# EAGLE design repeater (EAGLE 7.2.0)
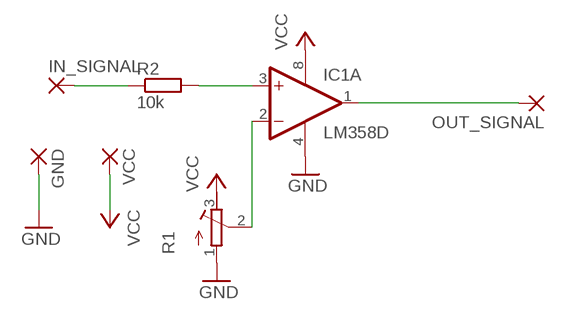
[diagram p0: schematic, sheet 1]

## Parts
GND  SMD5  [SMD2,54-5,08]
IC1  LM358D  [SO08]
IN_SIGNAL  SMD5  [SMD2,54-5,08]
OUT_SIGNAL  SMD5  [SMD2,54-5,08]
R1  R-TRIMM3296W  [RTRIM3296W]
R2  10k  R-EU_R0805  [R0805]
VCC  SMD5  [SMD2,54-5,08]

## Nets
GND: GND.1(P) IC1.4(P:V-) R1.1(A)
N$1: IC1.2(A:-IN) R1.2(S)
N$2: IC1.3(A:+IN) R2.2
N$3: IN_SIGNAL.1(P) R2.1
N$4: IC1.1(A:OUT) OUT_SIGNAL.1(P)
VCC: IC1.8(P:V+) R1.3(E) VCC.1(P)
Unconnected: IC1.5(B:+IN) IC1.6(B:-IN) IC1.7(B:OUT)

## Library data of the parts
GND IN_SIGNAL OUT_SIGNAL VCC = wirepad:SMD5: SMD PAD
IC1 = linear:LM358: OP AMP also LM158; LM258; LM2904 Source: http://cache.national.com/ds/LM/LM158.pdf
R1 = rcl:R-TRIMM: Trimm resistor
R2 = rcl:R-EU_: RESISTOR, European symbol

## Board
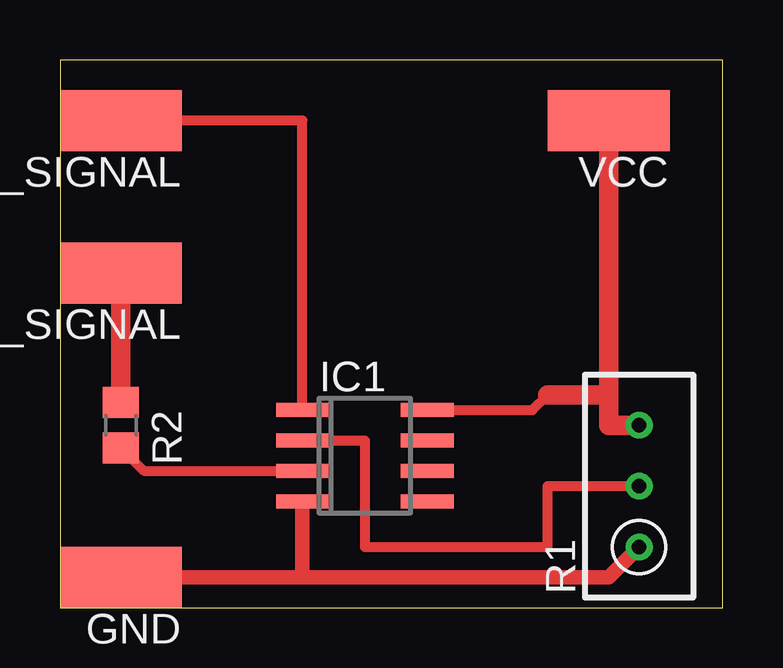
[diagram p1: board, top side]

Size 27.61 x 22.85 mm. Coordinates in mm from the lower left corner, seen from the top.
Outline: 0,0 27.61,0 27.61,22.85 0,22.85 0,0
Copper layers (1*16): Top 0.035mm / dielectric 1.5mm / Bottom 0.035mm
Design rules "default": minimum track width 10mil, minimum drill 24mil, track to track 8mil, track to pad 8mil, pad to pad 8mil, via to via 8mil, smd to smd 8mil, copper to edge 40mil, drill to drill 8mil, minimum pad ring 10mil, minimum via ring 8mil, stop-mask expansion 4mil, vias tented up to drill 0mil, thermal gap 10mil

### Footprints (pad centres in the part's own frame; a part is rotated, then mirrored left to right if it is on the bottom)
SMD2,54-5,08 = smd 2.54 x 5.08: 1 0,0
SO08 = smd 0.6 x 2.2: 1 -1.905,-2.6; 2 -0.635,-2.6; 3 0.635,-2.6; 4 1.905,-2.6; 5 1.905,2.6; 6 0.635,2.6; 7 -0.635,2.6; 8 -1.905,2.6
RTRIM3296W = drill 0.61: 1 0,-2.54; 2 0,0; 3 0,2.54
R0805 = smd 1.3 x 1.5: 1 -0.95,0; 2 0.95,0

### Placement (x,y rotation side)
GND  2.54,1.27 90 top
IC1  12.7,6.35 270 top
IN_SIGNAL  2.54,13.97 90 top
OUT_SIGNAL  2.54,20.32 90 top
R1  24.13,5.08 0 top
R2  2.54,7.62 270 top
VCC  22.86,20.32 90 top

### Tracks (layer width: path | path; a pad name or v marks a point on that pad's centre or on a via)
GND
  Top 0.61: GND.1 10.16,1.27 | 10.16,1.27 22.86,1.27 R1.1 | IC1.4 10.1,1.33 10.16,1.27
N$1
  Top 0.406: IC1.2 12.7,6.99 12.7,2.54 20.32,2.54 20.32,5.08 R1.2
N$2
  Top 0.406: R2.2 3.5,5.71 IC1.3
N$3
  Top 0.813: IN_SIGNAL.1 R2.1
N$4
  Top 0.406: IC1.1 10.1,20.32 OUT_SIGNAL.1
VCC
  Top 0.406: IC1.8 19.68,8.26 20.32,8.89
  Top 0.813: VCC.1 22.86,8.89 | R1.3 22.86,7.62 22.86,8.89 | 22.86,8.89 20.32,8.89